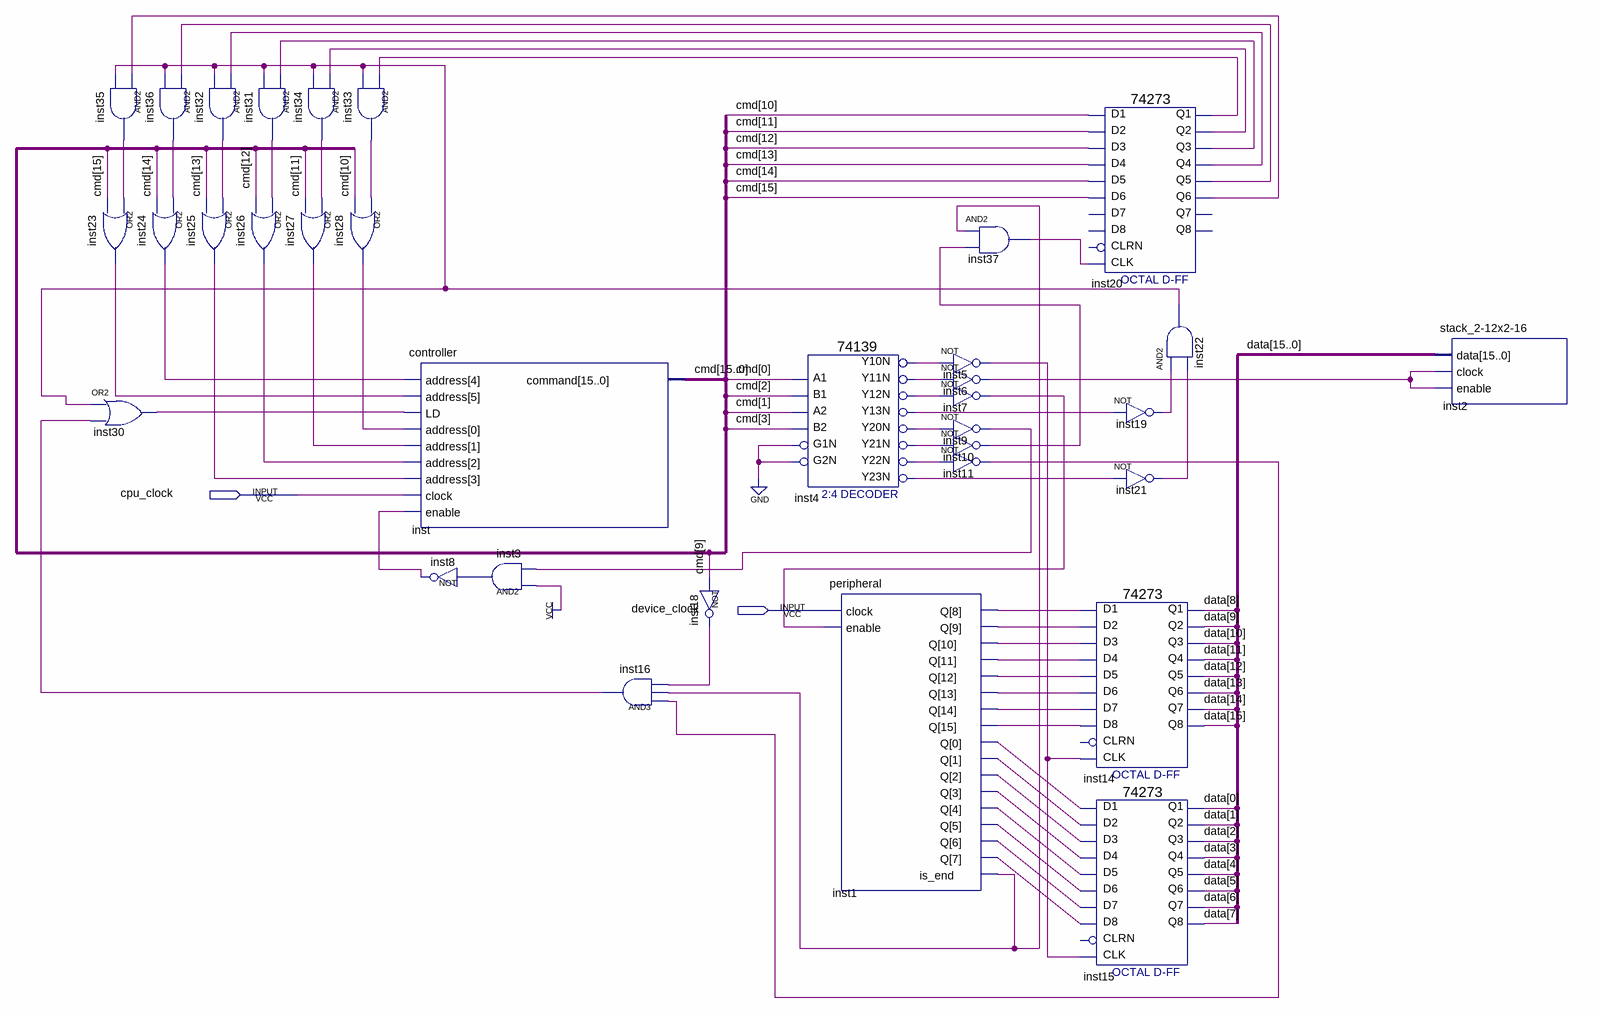
[diagram p0: schematic sheet]
// Quartus schematic ProgramInterruptMethod.bdf as structural Verilog: 34 symbols, 2 pins
module ProgramInterruptMethod (
  input  cpu_clock,
  input  device_clock
);

  wire inst1_is_end, inst1_q, inst1_q_2, inst1_q_3, inst1_q_4, inst1_q_5, inst1_q_6, inst1_q_7, inst1_q_8,
       inst1_q_9, inst1_q_10, inst1_q_11, inst1_q_12, inst1_q_13, inst1_q_14, inst1_q_15, inst1_q_16,
       inst3_out, inst4_y10n, inst4_y11n, inst4_y12n, inst4_y13n, inst4_y20n, inst4_y21n, inst4_y22n,
       inst4_y23n, inst5_out, inst6_out, inst7_out, inst8_out, inst9_out, inst10_out, inst11_out, inst16_out,
       inst18_out, inst19_out, inst20_q1, inst20_q2, inst20_q3, inst20_q4, inst20_q5, inst20_q6, inst21_out,
       inst22_out, inst23_out, inst24_out, inst25_out, inst26_out, inst27_out, inst28_out, inst30_out,
       inst31_out, inst32_out, inst33_out, inst34_out, inst35_out, inst36_out, inst37_out;
  wire [15:0] cmd, data;

  and inst35 (inst35_out, inst20_q6, inst22_out);
  or inst23 (inst23_out, inst35_out, cmd[15]);
  or inst30 (inst30_out, inst22_out, inst16_out);
  and inst32 (inst32_out, inst20_q4, inst22_out);
  and inst36 (inst36_out, inst20_q5, inst22_out);
  or inst24 (inst24_out, inst36_out, cmd[14]);
  or inst25 (inst25_out, inst32_out, cmd[13]);
  and inst31 (inst31_out, inst20_q3, inst22_out);
  or inst26 (inst26_out, inst31_out, cmd[12]);
  and inst34 (inst34_out, inst20_q2, inst22_out);
  or inst27 (inst27_out, inst34_out, cmd[11]);
  and inst33 (inst33_out, inst20_q1, inst22_out);
  or inst28 (inst28_out, inst33_out, cmd[10]);
  controller inst (
    .address({inst23_out, inst24_out, inst25_out, inst26_out, inst27_out, inst28_out}), .LD(inst30_out),
    .clock(cpu_clock), .enable(inst8_out), .command(cmd));
  not inst8 (inst8_out, inst3_out);
  and inst3 (inst3_out, 1'b1, inst9_out);
  and inst16 (inst16_out, inst11_out, inst1_is_end, inst18_out);
  not inst18 (inst18_out, cmd[9]);
  \74139  inst4 (
    .A1(cmd[0]), .A2(cmd[1]), .B1(cmd[2]), .B2(cmd[3]), .G1N(1'b0), .G2N(1'b0), .Y10N(inst4_y10n),
    .Y20N(inst4_y20n), .Y13N(inst4_y13n), .Y12N(inst4_y12n), .Y11N(inst4_y11n), .Y21N(inst4_y21n),
    .Y22N(inst4_y22n), .Y23N(inst4_y23n));
  peripheral inst1 (
    .clock(device_clock), .enable(inst7_out),
    .Q({inst1_q_16, inst1_q_15, inst1_q_14, inst1_q_13, inst1_q_12, inst1_q_11, inst1_q_10, inst1_q_9, inst1_q_8, inst1_q_7, inst1_q_6, inst1_q_5, inst1_q_4, inst1_q_3, inst1_q_2, inst1_q}),
    .is_end(inst1_is_end));
  and inst37 (inst37_out, inst1_is_end, inst10_out);
  not inst5 (inst5_out, inst4_y10n);
  not inst6 (inst6_out, inst4_y11n);
  not inst7 (inst7_out, inst4_y12n);
  not inst9 (inst9_out, inst4_y20n);
  not inst10 (inst10_out, inst4_y21n);
  not inst11 (inst11_out, inst4_y22n);
  \74273  inst20 (
    .D2(cmd[11]), .D3(cmd[12]), .D1(cmd[10]), .D4(cmd[13]), .D6(cmd[15]), .D5(cmd[14]), .CLK(inst37_out),
    .Q4(inst20_q4), .Q1(inst20_q1), .Q2(inst20_q2), .Q3(inst20_q3), .Q6(inst20_q6), .Q5(inst20_q5));  // open: D7, D8, CLRN, Q7, Q8
  not inst19 (inst19_out, inst4_y13n);
  not inst21 (inst21_out, inst4_y23n);
  \74273  inst14 (
    .D2(inst1_q_10), .D3(inst1_q_11), .D1(inst1_q_9), .D4(inst1_q_12), .D7(inst1_q_15), .D6(inst1_q_14),
    .D5(inst1_q_13), .D8(inst1_q_16), .CLK(inst5_out), .Q4(data[11]), .Q1(data[8]), .Q2(data[9]),
    .Q3(data[10]), .Q6(data[13]), .Q5(data[12]), .Q7(data[14]), .Q8(data[15]));  // open: CLRN
  \74273  inst15 (
    .D2(inst1_q_2), .D3(inst1_q_3), .D1(inst1_q), .D4(inst1_q_4), .D7(inst1_q_7), .D6(inst1_q_6),
    .D5(inst1_q_5), .D8(inst1_q_8), .CLK(inst5_out), .Q4(data[3]), .Q1(data[0]), .Q2(data[1]), .Q3(data[2]),
    .Q6(data[5]), .Q5(data[4]), .Q7(data[6]), .Q8(data[7]));  // open: CLRN
  and inst22 (inst22_out, inst19_out, inst21_out);
  \stack_2-12x2-16  inst2 (.data(data), .clock(inst6_out), .enable(inst6_out));
endmodule
